# Altium project Audio_Research.PrjPcb (part 3 of 6)

## Sheet Audio_Output_Line_Out.SchDoc: Audio Research: Line Out
size A4; DrawnBy: Connor Dack; Engineer: Connor Dack; DocumentNumber: 18; Revision: 1.0; SheetNumber: 18; SheetTotal: 20
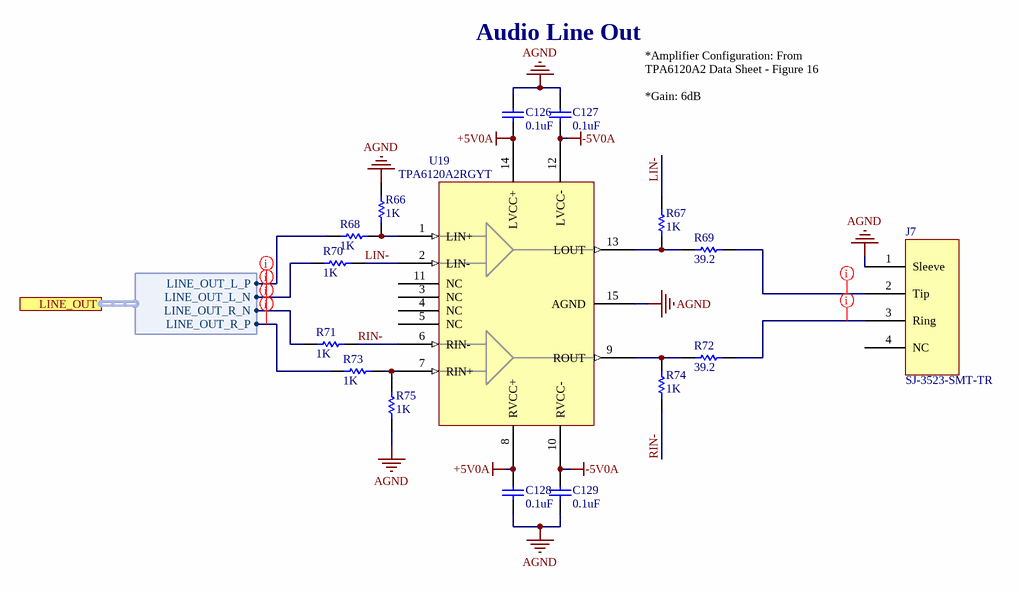
[diagram p8: Audio_Output_Line_Out.SchDoc]

### Parts
C126  Capacitance: 0.1uF  [3-0603_L]  (hidden comment: CL10F104ZO8NNNC)
C127  Capacitance: 0.1uF  [3-0603_L]  (hidden comment: CL10F104ZO8NNNC)
C128  Capacitance: 0.1uF  [3-0603_L]  (hidden comment: CL10F104ZO8NNNC)
C129  Capacitance: 0.1uF  [3-0603_L]  (hidden comment: CL10F104ZO8NNNC)
J7  SJ-3523-SMT-TR  [SJ-3523-SMT-TR]
R66  Resistance (Ohms): 1K  [3-0603_R_L]  (hidden comment: ERJ-3EKF1001V)
R67  Resistance (Ohms): 1K  [3-0603_R_L]  (hidden comment: ERJ-3EKF1001V)
R68  Resistance (Ohms): 1K  [3-0603_R_L]  (hidden comment: ERJ-3EKF1001V)
R69  Resistance (Ohms): 39.2  [3-0603_R_L]  (hidden comment: ERJ-3EKF39R2V)
R70  Resistance (Ohms): 1K  [3-0603_R_L]  (hidden comment: ERJ-3EKF1001V)
R71  Resistance (Ohms): 1K  [3-0603_R_L]  (hidden comment: ERJ-3EKF1001V)
R72  Resistance (Ohms): 39.2  [3-0603_R_L]  (hidden comment: ERJ-3EKF39R2V)
R73  Resistance (Ohms): 1K  [3-0603_R_L]  (hidden comment: ERJ-3EKF1001V)
R74  Resistance (Ohms): 1K  [3-0603_R_L]  (hidden comment: ERJ-3EKF1001V)
R75  Resistance (Ohms): 1K  [3-0603_R_L]  (hidden comment: ERJ-3EKF1001V)
U19  TPA6120A2RGYT  [PQFN50P350X350X100_HS-15N]

### Ports
LINE_OUT (harness LINE_OUT)

### Harnesses
LINE_OUT: LINE_OUT_L_N, LINE_OUT_L_P, LINE_OUT_R_N, LINE_OUT_R_P

### Nets
+5V0A: C126.2 C128.1 U19.8(RVCC+) U19.14(LVCC+)
-5V0A: C127.2 C129.1 U19.10(RVCC-) U19.12(LVCC-)
AGND: C126.1 C127.1 C128.2 C129.2 J7.1(Sleeve) R66.2 R75.1 U19.15(AGND)
LIN-: R67.1 R70.2 U19.2(LIN-)
RIN-: R71.2 R74.2 U19.6(RIN-)
NetJ7_2: J7.2(Tip) R69.2
NetJ7_3: J7.3(Ring) R72.2
NetR66_1: R66.1 R68.2 U19.1(LIN+)
NetR67_2: R67.2 R69.1 U19.13(LOUT)
NetR68_1: R68.1 ; port LINE_OUT.LINE_OUT_L_P
NetR70_1: R70.1 ; port LINE_OUT.LINE_OUT_L_N
NetR71_1: R71.1 ; port LINE_OUT.LINE_OUT_R_N
NetR72_1: R72.1 R74.1 U19.9(ROUT)
NetR73_1: R73.1 ; port LINE_OUT.LINE_OUT_R_P
NetR73_2: R73.2 R75.2 U19.7(RIN+)

Not connected (* = marked no-connect by the designer): J7 4(NC); U19 3(NC) 4(NC) 5(NC) 11(NC)

### Layout directives
net class Line_Out: NetR68_1, NetR70_1, NetR71_1, NetR73_1
net class Line_Out_3.5mm: NetJ7_2, NetJ7_3

### Notes on the sheet
- Audio Line Out
- *Amplifier Configuration: From TPA6120A2 Data Sheet - Figure 16
  *Gain: 6dB
- Title:
- Sheet:
- of
- Size:
- A4
- Rev:
- Date:
- Engineer:
- Time:
- File:
- (in symbol TPA6120A2RGYT) -; +

### Library data of the parts
C126-C129 = CL10F104ZO8NNNC: as C3 on sheet Audio_Codec; Supplier 1: Digi-Key; Stock 1: 40000; Pricing 1: 1=0.1, 10=0.038, 100=0.0169, 500=0.01208, 1000=0.00949 (USD); Mount: Surface Mount; Case/Package: 0603; Case Code (Metric): 1608; Case Code (Imperial): 0603; Min Operating Temperature: -30°C; Max Operating Temperature: 85°C; Package Quantity: 1; Packaging: Tape and Reel; Voltage Rating: 16V; Dielectric: Y5V; Length: 1.6mm; Height: 0.8mm; Width: 0.031inch; Thickness: 0.035inch; Depth: 0.8mm; Radiation Hardening: No; ComponentLink1URL: https://datasheet.ciiva.com/25805/cl10f104zo8nnnc-25805810.pdf; ComponentLink1Description: https://datasheet.ciiva.com/25805/cl10f104zo8nnnc-25805810.pdf; ComponentLink2URL: https://datasheet.ciiva.com/16199/cl10f104zo8nnnc-16199254.pdf; ComponentLink2Description: https://datasheet.ciiva.com/16199/cl10f104zo8nnnc-16199254.pdf; Supplier Part Number 1: 1276-1258-6-ND; Manufacturer Part Number: CL10F104ZO8NNNC
J7 = SJ-3523-SMT-TR: as J3 on sheet Audio_Input_Line_In; LatestRevisionDate: 17-Jul-2002; LatestRevisionNote: Re-released for DXP Platform.; Publisher: Altium Limited; Supplier 1: Digi-Key; RoHS: RoHS Compliant; Category: Connectors, Interconnects; Stock 1: 104981; Pricing 1: 1=1.34, 10=1.043, 100=0.7961, 500=0.63558 (USD); Packaging: Cut Tape (CT); Part Status: Active; Connector Type: Phone Jack; Signal Lines: Stereo; Industry Recognized Mating Diameter: 3.50mm (0.141", 1/8", Mini Plug) - Headphone; Mounting Type: Surface Mount, Right Angle; Termination: Solder; Features: Board Guide; Insulation Color: -; Contact Material - Plating: Silver; Body Material: -; ComponentLink1URL: http://www.cui.com/product/resource/digikeypdf/sj-352x-smt_series.pdf; ComponentLink1Description: http://www.cui.com/product/resource/digikeypdf/sj-352x-smt_series.pdf; Supplier Part Number 1: CP-3523SJCT-ND; Manufacturer Part Number: SJ-3523-SMT-TR
R66-R68 R70 R71 R73-R75 = ERJ-3EKF1001V: RES 1.00K OHM 1/10W 1% 0603 SMD; Manufacturer: Panasonic - ECG; Power (Watts): 0.1W, 1/10W; Temperature Coefficient: ±100ppm/°C; Supplier 1: Digi-Key; Manufacturer Part Number: ERJ-3EKF1001V; RoHS: RoHS Compliant; Category: Resistors; Stock 1: 5088743; Pricing 1: 1=0.04, 50=0.0138, 100=0.0105, 250=0.0078, 500=0.00576, 1000=0.00384 (USD); Composition: Thick Film; Features: -; Tolerance: ±1%; Package / Case: 0603 (1608 Metric); Size / Dimension: 0.063" L x 0.031" W (1.60mm x 0.80mm); Height: 0.022" (0.55mm); Number of Terminations: 2; Packaging: Cut Tape (CT); ComponentLink1URL: http://industrial.panasonic.com/www-cgi/jvcr13pz.cgi?E+PZ+3+AOA0002+ERJ3EKF1001V+7+WW; ComponentLink1Description: http://industrial.panasonic.com/www-cgi/jvcr13pz.cgi?E+PZ+3+AOA0002+ERJ3EKF1001V+7+WW; Supplier Part Number 1: P1.00KHCT-ND
R69 R72 = ERJ-3EKF39R2V: n RES SMD 39.2 OHM 1% 1/10W 0603; Manufacturer: Panasonic Electronic Components; Power (Watts): 0.1W, 1/10W; Temperature Coefficient: ±100ppm/°C; Supplier 1: Digi-Key; Manufacturer Part Number: ERJ-3EKF39R2V; RoHS: RoHS Compliant; Category: Resistors; Stock 1: 34148; Pricing 1: 1=0.1, 50=0.0114, 100=0.0084, 250=0.00644, 500=0.00514, 1000=0.00379 (USD); Packaging: Cut Tape (CT); Part Status: Active; Tolerance: ±1%; Composition: Thick Film; Features: Automotive AEC-Q200; Operating Temperature: -55°C ~ 155°C; Package / Case: 0603 (1608 Metric); Supplier Device Package: 0603; Size / Dimension: 0.063" L x 0.031" W (1.60mm x 0.80mm); Height: 0.022" (0.55mm); Number of Terminations: 2; ComponentLink1URL: http://industrial.panasonic.com/www-cgi/jvcr13pz.cgi?E+PZ+3+AOA0002+ERJ3EKF39R2V+7+WW; ComponentLink1Description: http://industrial.panasonic.com/www-cgi/jvcr13pz.cgi?E+PZ+3+AOA0002+ERJ3EKF39R2V+7+WW; Supplier Part Number 1: P39.2HCT-ND
U19 = TPA6120A2RGYT: Amplifier IC Headphones, 2-Channel (Stereo) Class AB 14-VQFN (3.5x3.5); Manufacturer: Texas Instruments; Max Output Power x Channels @ Load: 80mW x 2 @ 600 Ohm; Voltage - Supply: 10 V ~ 30 V, ±5 V ~ 15 V; LatestRevisionDate: 17-Jul-2002; LatestRevisionNote: Re-released for DXP Platform.; Publisher: Altium Limited; Supplier 1: Digi-Key; RoHS: RoHS Compliant; Category: Integrated Circuits (ICs); Stock 1: 867; Pricing 1: 1=6.04, 10=5.424, 100=4.4501 (USD); Packaging: Cut Tape (CT); Part Status: Active; Type: Class AB; Output Type: Headphones, 2-Channel (Stereo); Features: Differential Inputs, Short-Circuit and Thermal Protection; Mounting Type: Surface Mount; Operating Temperature: -40°C ~ 85°C (TA); Supplier Device Package: 14-VQFN (3.5x3.5); Package / Case: 14-VFQFN Exposed Pad; ComponentLink1URL: http://www.ti.com/lit/ds/symlink/tpa6120a2.pdf; ComponentLink1Description: http://www.ti.com/lit/ds/symlink/tpa6120a2.pdf; Supplier Part Number 1: 296-38029-1-ND; Manufacturer Part Number: TPA6120A2RGYT

## Sheet Audio_Output_XLR1.SchDoc: Audio Research: XLR 1 Out
size A4; DrawnBy: Connor Dack; Engineer: Connor Dack; DocumentNumber: 19; Revision: 1.0; SheetNumber: 19; SheetTotal: 20
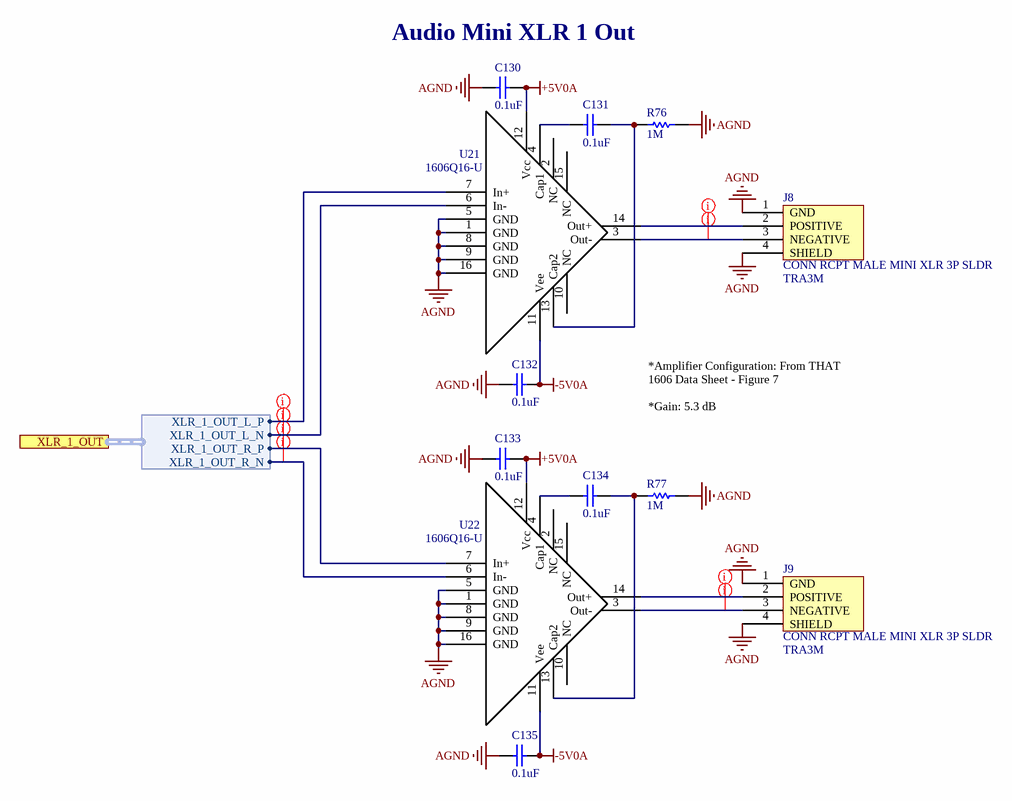
[diagram p9: Audio_Output_XLR1.SchDoc]

### Parts
C130  Capacitance: 0.1uF  [3-0603_L]  (hidden comment: CL10F104ZO8NNNC)
C131  Capacitance: 0.1uF  [3-0603_L]  (hidden comment: CL10F104ZO8NNNC)
C132  Capacitance: 0.1uF  [3-0603_L]  (hidden comment: CL10F104ZO8NNNC)
C133  Capacitance: 0.1uF  [3-0603_L]  (hidden comment: CL10F104ZO8NNNC)
C134  Capacitance: 0.1uF  [3-0603_L]  (hidden comment: CL10F104ZO8NNNC)
C135  Capacitance: 0.1uF  [3-0603_L]  (hidden comment: CL10F104ZO8NNNC)
J8  CONN RCPT MALE MINI XLR 3P SLDR  [TRA3M]
J9  CONN RCPT MALE MINI XLR 3P SLDR  [TRA3M]
R76  Resistance: 1M  [3-0603_R_L]  (hidden comment: RMCF0603FG1M00)
R77  Resistance: 1M  [3-0603_R_L]  (hidden comment: RMCF0603FG1M00)
U21  1606Q16-U  [SOP64P600X175-16N]
U22  1606Q16-U  [SOP64P600X175-16N]

### Ports
XLR_1_OUT (harness XLR_1_OUT)

### Harnesses
XLR_1_OUT: XLR_1_OUT_L_N, XLR_1_OUT_L_P, XLR_1_OUT_R_N, XLR_1_OUT_R_P

### Nets
+5V0A: C130.1 C133.1 U21.12(Vcc) U22.12(Vcc)
-5V0A: C132.1 C135.1 U21.11(Vee) U22.11(Vee)
AGND: C130.2 C132.2 C133.2 C135.2 J8.1(GND) J8.4(SHIELD) J9.1(GND) J9.4(SHIELD) R76.2 R77.2 U21.1(GND) U21.5(GND) U21.8(GND) U21.9(GND) U21.16(GND) U22.1(GND) U22.5(GND) U22.8(GND) U22.9(GND) U22.16(GND)
NetC131_1: C131.1 R76.1 U21.13(Cap2)
NetC131_2: C131.2 U21.4(Cap1)
NetC134_1: C134.1 R77.1 U22.13(Cap2)
NetC134_2: C134.2 U22.4(Cap1)
NetJ8_2: J8.2(POSITIVE) U21.14(Out+)
NetJ8_3: J8.3(NEGATIVE) U21.3(Out-)
NetJ9_2: J9.2(POSITIVE) U22.14(Out+)
NetJ9_3: J9.3(NEGATIVE) U22.3(Out-)
NetU1_6: U21.7(In+) ; port XLR_1_OUT.XLR_1_OUT_L_P
NetU1_7: U21.6(In-) ; port XLR_1_OUT.XLR_1_OUT_L_N
NetU1_8: U22.7(In+) ; port XLR_1_OUT.XLR_1_OUT_R_P
NetU1_9: U22.6(In-) ; port XLR_1_OUT.XLR_1_OUT_R_N

Not connected (* = marked no-connect by the designer): U21 2(NC) 10(NC) 15(NC); U22 2(NC) 10(NC) 15(NC)

### Layout directives
net class XLR_1_Out: NetU1_6, NetU1_7, NetU1_8, NetU1_9
net class XLR_1_Out_Conn: NetJ8_2, NetJ8_3, NetJ9_2, NetJ9_3

### Notes on the sheet
- (near C130) Audio Mini XLR 1 Out
- *Amplifier Configuration: From THAT 1606 Data Sheet - Figure 7
  *Gain: 5.3 dB
- Title:
- Sheet:
- of
- Size:
- A4
- Rev:
- Date:
- Engineer:
- Time:
- File:

### Library data of the parts
C130-C135 = CL10F104ZO8NNNC: as C3 on sheet Audio_Codec; Supplier 1: Digi-Key; Stock 1: 40000; Pricing 1: 1=0.1, 10=0.038, 100=0.0169, 500=0.01208, 1000=0.00949 (USD); Mount: Surface Mount; Case/Package: 0603; Case Code (Metric): 1608; Case Code (Imperial): 0603; Min Operating Temperature: -30°C; Max Operating Temperature: 85°C; Package Quantity: 1; Packaging: Tape and Reel; Voltage Rating: 16V; Dielectric: Y5V; Length: 1.6mm; Height: 0.8mm; Width: 0.031inch; Thickness: 0.035inch; Depth: 0.8mm; Radiation Hardening: No; ComponentLink1URL: https://datasheet.ciiva.com/25805/cl10f104zo8nnnc-25805810.pdf; ComponentLink1Description: https://datasheet.ciiva.com/25805/cl10f104zo8nnnc-25805810.pdf; ComponentLink2URL: https://datasheet.ciiva.com/16199/cl10f104zo8nnnc-16199254.pdf; ComponentLink2Description: https://datasheet.ciiva.com/16199/cl10f104zo8nnnc-16199254.pdf; Supplier Part Number 1: 1276-1258-6-ND; Manufacturer Part Number: CL10F104ZO8NNNC
J8 J9 = TRA3M: 3 Position Circular Connector Receptacle, Male Pins Solder Silver; Manufacturer: Switchcraft; Body Material: Metal,Copper Alloy; Max Current Rating: 5A; Max Voltage Rating (AC): 125V; Voltage Rating: 250V; Connector Type: Receptacle,Pin; Number of Positions: 3; Number of Ports: 1; Wire/Cable Gauge: 28AWG; Supplier 1: Digi-Key; Stock 1: 295; Pricing 1: 1=12.74, 10=9.754, 25=9.5096, 50=8.7782, 100=8.2906, 250=7.9248 (USD); Mount: Through Hole,Panel,Bulkhead,PCB; Case/Package: Metal; Contact Material: Brass,Copper Alloy; Contact Plating: Nickel,Tin,Silver; Colour: Black; Number of Terminals: 3; Housing Material: Copper Alloy; Insulation Material: Thermoplastic; Min Operating Temperature: -55°C; Max Operating Temperature: 85°C; Package Quantity: 1; Current Rating: 5A; Fastening Type: Threaded; Packaging: Bulk; Gender: Male; Termination: Solder; Number of Contacts: 3; Orientation: Right Angle; Length: 15.49mm; Height: 15.24mm; Depth: 26.92mm; REACH SVHC: No SVHC; Lead Free: Lead Free; ComponentLink1URL: https://datasheet.ciiva.com/7327/tra3m-series-cd-7327368.pdf; ComponentLink1Description: https://datasheet.ciiva.com/7327/tra3m-series-cd-7327368.pdf; ComponentLink2URL: https://datasheet.ciiva.com/16879/70214235-16879259.pdf; ComponentLink2Description: https://datasheet.ciiva.com/16879/70214235-16879259.pdf; ComponentLink3URL: https://datasheet.ciiva.com/8053/28686-8053836.pdf; ComponentLink3Description: https://datasheet.ciiva.com/8053/28686-8053836.pdf; Supplier Part Number 1: SC1550-ND; Manufacturer Part Number: TRA3M
R76 R77 = RMCF0603FG1M00: RES 1M OHM 1% 1/10W 0603; Manufacturer: Stackpole Electronics; Max Power Dissipation: 100mW; Temperature Coefficient: 100ppm/°C; Supplier 1: Digi-Key; Manufacturer Part Number: RMCF0603FG1M00; Stock 1: 129722; Pricing 1: 1=0.1, 10=0.017, 100=0.0069, 1000=0.00309, 2500=0.00268, 5000=0.00222 (USD); Mount: Surface Mount; Case/Package: 0603; Case Code (Metric): 1608; Case Code (Imperial): 0603; Contact Plating: Tin,Matte; Min Operating Temperature: -55°C; Max Operating Temperature: 155°C; Package Quantity: 1; Packaging: Tape and Reel; Tolerance: 1%; Composition: Thick Film; Number of Terminations: 2; Length: 0.061inch; Height: 0.022inch; Width: 0.031inch; Radiation Hardening: No; Lead Free: Contains Lead; ComponentLink1URL: https://www.seielect.com/Catalog/SEI-RMCF_RMCP.pdf; ComponentLink1Description: https://www.seielect.com/Catalog/SEI-RMCF_RMCP.pdf; ComponentLink2URL: https://www.seielect.com/catalog/SEI-Packaging.pdf; ComponentLink2Description: https://www.seielect.com/catalog/SEI-Packaging.pdf; Supplier Part Number 1: RMCF0603FG1M00CT-ND
U21 U22 = 1606Q16-U: Audio Amplifiers Balanced Audio Line Driver IC; Manufacturer: THAT; Max Supply Voltage: 18V; Min Supply Voltage: 4V; Nominal Supply Current: 4.9mA; Supplier 1: Mouser; Stock 1: 3475; Pricing 1: 1=4.65, 10=4.65, 50=3.91, 100=3.35, 1000=2.79, 10000=2.6 (USD); Case/Package: QSOP; Min Operating Temperature: -40°C; Max Operating Temperature: 85°C; Package Quantity: 98; Packaging: Rail/Tube; ComponentLink1URL: http://www.mouser.com/ds/2/407/1600data-6754.pdf; ComponentLink1Description: http://www.mouser.com/ds/2/407/1600data-6754.pdf; Supplier Part Number 1: 887-1606Q16-U; Manufacturer Part Number: 1606Q16-U

## Sheet Audio_Output_XLR2.SchDoc: Audio Out: Mini XLR 2
size 279 x 215 mm; DrawnBy: Connor Dack; Engineer: Connor Dack; DocumentNumber: 20; Revision: 1.0; SheetNumber: 20; SheetTotal: 20
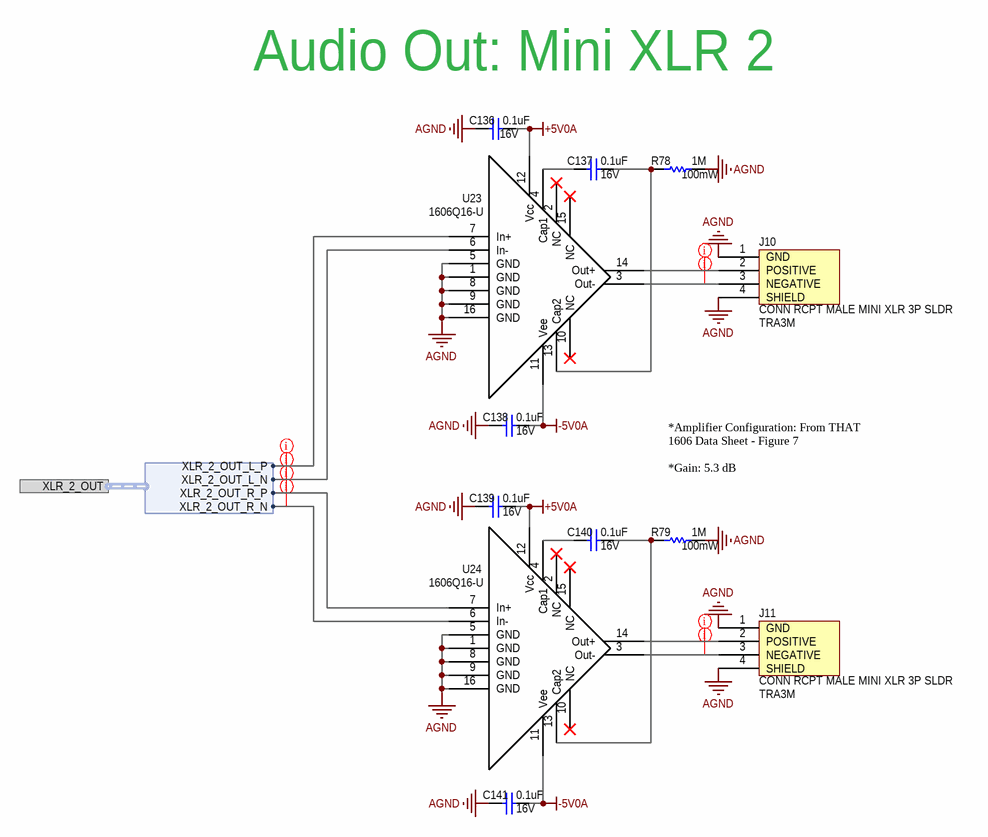
[diagram p10: Audio_Output_XLR2.SchDoc]

### Parts
C136  Voltage Rating: 16V  Capacitance: 0.1uF  [3-0603_L]  (hidden comment: CL10F104ZO8NNNC)
C137  Voltage Rating: 16V  Capacitance: 0.1uF  [3-0603_L]  (hidden comment: CL10F104ZO8NNNC)
C138  Voltage Rating: 16V  Capacitance: 0.1uF  [3-0603_L]  (hidden comment: CL10F104ZO8NNNC)
C139  Voltage Rating: 16V  Capacitance: 0.1uF  [3-0603_L]  (hidden comment: CL10F104ZO8NNNC)
C140  Voltage Rating: 16V  Capacitance: 0.1uF  [3-0603_L]  (hidden comment: CL10F104ZO8NNNC)
C141  Voltage Rating: 16V  Capacitance: 0.1uF  [3-0603_L]  (hidden comment: CL10F104ZO8NNNC)
J10  CONN RCPT MALE MINI XLR 3P SLDR  [TRA3M]
J11  CONN RCPT MALE MINI XLR 3P SLDR  [TRA3M]
R78  Max Power Dissipation: 100mW  Resistance: 1M  [3-0603_R_L]  (hidden comment: RMCF0603FG1M00)
R79  Max Power Dissipation: 100mW  Resistance: 1M  [3-0603_R_L]  (hidden comment: RMCF0603FG1M00)
U23  1606Q16-U  [SOP64P600X175-16N]
U24  1606Q16-U  [SOP64P600X175-16N]

### Ports
XLR_2_OUT (harness XLR_2_OUT)

### Harnesses
XLR_2_OUT: XLR_2_OUT_L_N, XLR_2_OUT_L_P, XLR_2_OUT_R_N, XLR_2_OUT_R_P

### Nets
+5V0A: C136.1 C139.1 U23.12(Vcc) U24.12(Vcc)
-5V0A: C138.1 C141.1 U23.11(Vee) U24.11(Vee)
AGND: C136.2 C138.2 C139.2 C141.2 J10.1(GND) J10.4(SHIELD) J11.1(GND) J11.4(SHIELD) R78.2 R79.2 U23.1(GND) U23.5(GND) U23.8(GND) U23.9(GND) U23.16(GND) U24.1(GND) U24.5(GND) U24.8(GND) U24.9(GND) U24.16(GND)
NetC137_1: C137.1 R78.1 U23.13(Cap2)
NetC137_2: C137.2 U23.4(Cap1)
NetC140_1: C140.1 R79.1 U24.13(Cap2)
NetC140_2: C140.2 U24.4(Cap1)
NetJ10_2: J10.2(POSITIVE) U23.14(Out+)
NetJ10_3: J10.3(NEGATIVE) U23.3(Out-)
NetJ11_2: J11.2(POSITIVE) U24.14(Out+)
NetJ11_3: J11.3(NEGATIVE) U24.3(Out-)
NetU1_10: U23.7(In+) ; port XLR_2_OUT.XLR_2_OUT_L_P
NetU1_11: U23.6(In-) ; port XLR_2_OUT.XLR_2_OUT_L_N
NetU1_12: U24.7(In+) ; port XLR_2_OUT.XLR_2_OUT_R_P
NetU1_13: U24.6(In-) ; port XLR_2_OUT.XLR_2_OUT_R_N

Not connected (* = marked no-connect by the designer): U23 2(NC)* 10(NC)* 15(NC)*; U24 2(NC)* 10(NC)* 15(NC)*

### Layout directives
net class XLR_2_Out: NetU1_10, NetU1_11, NetU1_12, NetU1_13
net class XLR_2_Out_Conn: NetJ10_2, NetJ10_3, NetJ11_2, NetJ11_3

### Notes on the sheet
- (near C136) Audio Out: Mini XLR 2
- *Amplifier Configuration: From THAT 1606 Data Sheet - Figure 7
  *Gain: 5.3 dB
- Title:
- Sheet:
- of
- Size:
- 11 x 8.5 Inches
- Rev:
- Date:
- Engineer:
- Time:
- File:
- Copyright 2020 Audio Logic Inc
  THE HARDWARE IS PROVIDED "AS IS", WITHOUT WARRANTY OF ANY KIND, EXPRESS OR IMPLIED, INCLUDING BUT NOT LIMITED TO THE WARRANTIES OF MERCHANTABILITY, FITNESS FOR A PARTICULAR PURPOSE AND NONINFRINGEMENT. IN NO EVENT SHALL THE AUTHORS OR COPYRIGHT HOLDERS BE LIABLE FOR ANY CLAIM, DAMAGES OR OTHER LIABILITY, WHETHER IN AN ACTION OF CONTRACT, TORT OR OTHERWISE, ARISING FROM, OUT OF OR IN CONNECTION WITH THE HARDWARE OR THE USE OR OTHER DEALINGS IN THE HARDWARE.

### Library data of the parts
C136-C141 = CL10F104ZO8NNNC: as C3 on sheet Audio_Codec; Supplier 1: Digi-Key; Stock 1: 40000; Pricing 1: 1=0.1, 10=0.038, 100=0.0169, 500=0.01208, 1000=0.00949 (USD); Mount: Surface Mount; Case/Package: 0603; Case Code (Metric): 1608; Case Code (Imperial): 0603; Min Operating Temperature: -30°C; Max Operating Temperature: 85°C; Package Quantity: 1; Packaging: Tape and Reel; Dielectric: Y5V; Length: 1.6mm; Height: 0.8mm; Width: 0.031inch; Thickness: 0.035inch; Depth: 0.8mm; Radiation Hardening: No; ComponentLink1URL: https://datasheet.ciiva.com/25805/cl10f104zo8nnnc-25805810.pdf; ComponentLink1Description: https://datasheet.ciiva.com/25805/cl10f104zo8nnnc-25805810.pdf; ComponentLink2URL: https://datasheet.ciiva.com/16199/cl10f104zo8nnnc-16199254.pdf; ComponentLink2Description: https://datasheet.ciiva.com/16199/cl10f104zo8nnnc-16199254.pdf; Supplier Part Number 1: 1276-1258-6-ND; Manufacturer Part Number: CL10F104ZO8NNNC
J10 J11 = TRA3M: as J8 on sheet Audio_Output_XLR1; Supplier 1: Digi-Key; Stock 1: 295; Pricing 1: 1=12.74, 10=9.754, 25=9.5096, 50=8.7782, 100=8.2906, 250=7.9248 (USD); Mount: Through Hole,Panel,Bulkhead,PCB; Case/Package: Metal; Contact Material: Brass,Copper Alloy; Contact Plating: Nickel,Tin,Silver; Colour: Black; Number of Terminals: 3; Housing Material: Copper Alloy; Insulation Material: Thermoplastic; Min Operating Temperature: -55°C; Max Operating Temperature: 85°C; Package Quantity: 1; Current Rating: 5A; Fastening Type: Threaded; Packaging: Bulk; Gender: Male; Termination: Solder; Number of Contacts: 3; Orientation: Right Angle; Length: 15.49mm; Height: 15.24mm; Depth: 26.92mm; REACH SVHC: No SVHC; Lead Free: Lead Free; ComponentLink1URL: https://datasheet.ciiva.com/7327/tra3m-series-cd-7327368.pdf; ComponentLink1Description: https://datasheet.ciiva.com/7327/tra3m-series-cd-7327368.pdf; ComponentLink2URL: https://datasheet.ciiva.com/16879/70214235-16879259.pdf; ComponentLink2Description: https://datasheet.ciiva.com/16879/70214235-16879259.pdf; ComponentLink3URL: https://datasheet.ciiva.com/8053/28686-8053836.pdf; ComponentLink3Description: https://datasheet.ciiva.com/8053/28686-8053836.pdf; Supplier Part Number 1: SC1550-ND; Manufacturer Part Number: TRA3M
R78 R79 = RMCF0603FG1M00: RES 1M OHM 1% 1/10W 0603; Manufacturer: Stackpole Electronics; Temperature Coefficient: 100ppm/°C; Supplier 1: Digi-Key; Manufacturer Part Number: RMCF0603FG1M00; Stock 1: 129722; Pricing 1: 1=0.1, 10=0.017, 100=0.0069, 1000=0.00309, 2500=0.00268, 5000=0.00222 (USD); Mount: Surface Mount; Case/Package: 0603; Case Code (Metric): 1608; Case Code (Imperial): 0603; Contact Plating: Tin,Matte; Min Operating Temperature: -55°C; Max Operating Temperature: 155°C; Package Quantity: 1; Packaging: Tape and Reel; Tolerance: 1%; Composition: Thick Film; Number of Terminations: 2; Length: 0.061inch; Height: 0.022inch; Width: 0.031inch; Radiation Hardening: No; Lead Free: Contains Lead; ComponentLink1URL: https://www.seielect.com/Catalog/SEI-RMCF_RMCP.pdf; ComponentLink1Description: https://www.seielect.com/Catalog/SEI-RMCF_RMCP.pdf; ComponentLink2URL: https://www.seielect.com/catalog/SEI-Packaging.pdf; ComponentLink2Description: https://www.seielect.com/catalog/SEI-Packaging.pdf; Supplier Part Number 1: RMCF0603FG1M00CT-ND
U23 U24 = 1606Q16-U: as U21 on sheet Audio_Output_XLR1; Supplier 1: Mouser; Stock 1: 3475; Pricing 1: 1=4.65, 10=4.65, 50=3.91, 100=3.35, 1000=2.79, 10000=2.6 (USD); Case/Package: QSOP; Min Operating Temperature: -40°C; Max Operating Temperature: 85°C; Package Quantity: 98; Packaging: Rail/Tube; ComponentLink1URL: http://www.mouser.com/ds/2/407/1600data-6754.pdf; ComponentLink1Description: http://www.mouser.com/ds/2/407/1600data-6754.pdf; Supplier Part Number 1: 887-1606Q16-U; Manufacturer Part Number: 1606Q16-U